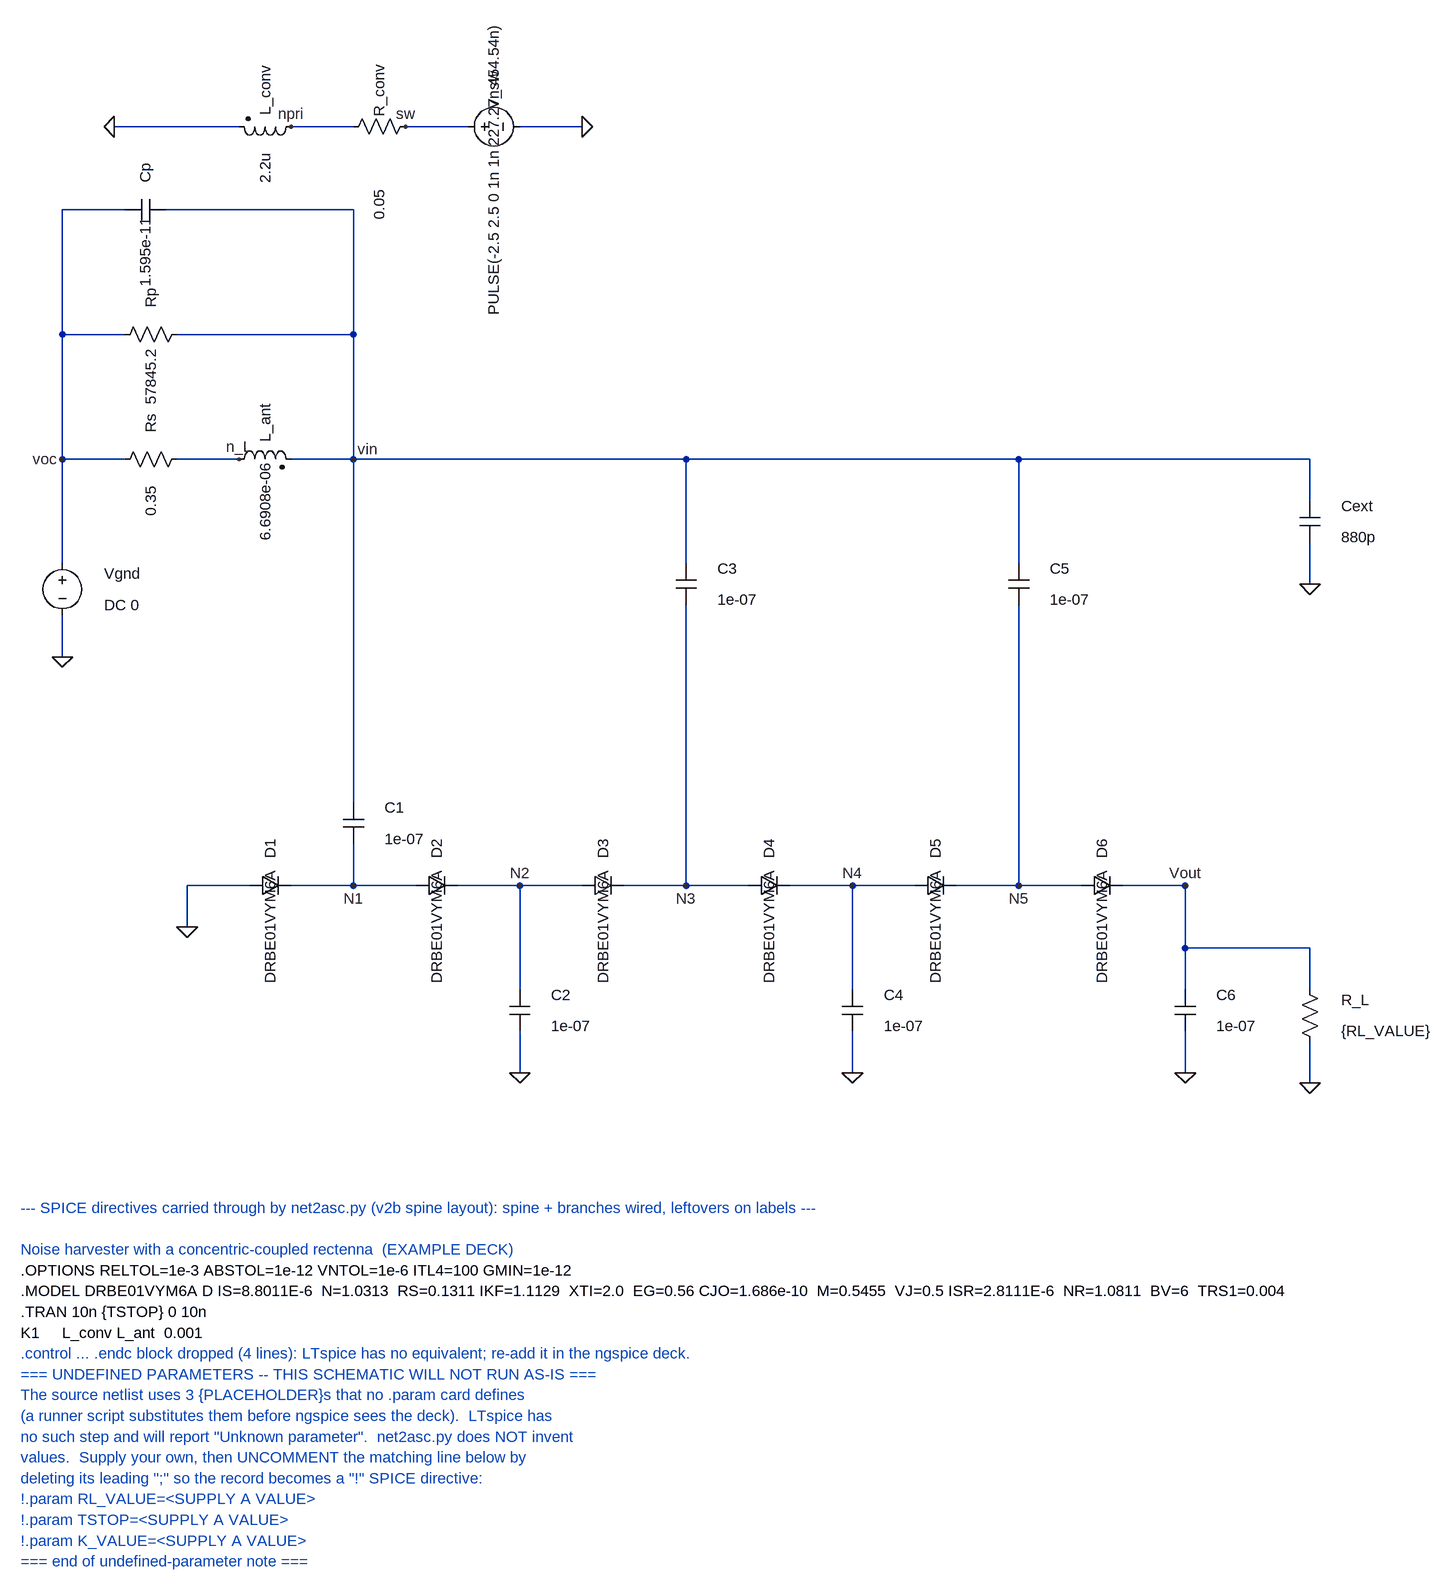
[diagram p0: schematic corrupt_G_kcoeff.asc]
corrupt_G_kcoeff.asc, the LTspice schematic file:
Version 4
SHEET 1 2688 2544
WIRE 320 1312 320 1376
WIRE 320 1312 416 1312
WIRE 480 1312 576 1312
WIRE 576 1312 672 1312
WIRE 736 1312 832 1312
WIRE 832 1312 928 1312
WIRE 992 1312 1088 1312
WIRE 1088 1312 1184 1312
WIRE 1248 1312 1344 1312
WIRE 1344 1312 1440 1312
WIRE 1504 1312 1600 1312
WIRE 1600 1312 1696 1312
WIRE 1760 1312 1856 1312
WIRE 576 1312 576 1248
WIRE 576 1184 576 656
WIRE 832 1312 832 1408
WIRE 832 1408 832 1472
WIRE 832 1536 832 1600
WIRE 576 656 1088 656
WIRE 1088 656 1088 752
WIRE 1088 752 1088 816
WIRE 1088 880 1088 1312
WIRE 1344 1312 1344 1408
WIRE 1344 1408 1344 1472
WIRE 1344 1536 1344 1600
WIRE 576 656 1600 656
WIRE 1600 656 1600 752
WIRE 1600 752 1600 816
WIRE 1600 880 1600 1312
WIRE 1856 1312 1856 1408
WIRE 1856 1408 1856 1472
WIRE 1856 1536 1856 1600
WIRE 1856 1312 1856 1408
WIRE 1856 1408 2048 1408
WIRE 2048 1408 2048 1472
WIRE 2048 1552 2048 1616
WIRE 576 656 480 656
WIRE 400 656 304 656
WIRE 224 656 128 656
WIRE 128 656 128 464
WIRE 128 464 224 464
WIRE 304 464 576 464
WIRE 576 464 576 656
WIRE 128 656 128 272
WIRE 128 272 224 272
WIRE 288 272 576 272
WIRE 576 272 576 656
WIRE 576 656 2048 656
WIRE 2048 656 2048 720
WIRE 2048 784 2048 848
WIRE 128 656 128 752
WIRE 128 752 128 816
WIRE 128 896 128 960
WIRE 208 144 304 144
WIRE 304 144 400 144
WIRE 480 144 576 144
WIRE 656 144 752 144
WIRE 832 144 928 144
FLAG 320 1376 0
FLAG 576 1312 N1
FLAG 832 1312 N2
FLAG 1088 1312 N3
FLAG 1344 1312 N4
FLAG 1600 1312 N5
FLAG 1856 1312 Vout
FLAG 576 656 vin
FLAG 832 1600 0
FLAG 1344 1600 0
FLAG 1856 1600 0
FLAG 2048 1616 0
FLAG 128 656 voc
FLAG 2048 848 0
FLAG 128 960 0
FLAG 208 144 0
FLAG 928 144 0
FLAG 400 656 n_L
FLAG 480 144 npri
FLAG 656 144 sw
SYMBOL diode 416 1328 R270
WINDOW 0 72 32 Center 2
WINDOW 3 -48 32 Center 2
SYMATTR InstName D1
SYMATTR Value DRBE01VYM6A
SYMBOL diode 672 1328 R270
WINDOW 0 72 32 Center 2
WINDOW 3 -48 32 Center 2
SYMATTR InstName D2
SYMATTR Value DRBE01VYM6A
SYMBOL diode 928 1328 R270
WINDOW 0 72 32 Center 2
WINDOW 3 -48 32 Center 2
SYMATTR InstName D3
SYMATTR Value DRBE01VYM6A
SYMBOL diode 1184 1328 R270
WINDOW 0 72 32 Center 2
WINDOW 3 -48 32 Center 2
SYMATTR InstName D4
SYMATTR Value DRBE01VYM6A
SYMBOL diode 1440 1328 R270
WINDOW 0 72 32 Center 2
WINDOW 3 -48 32 Center 2
SYMATTR InstName D5
SYMATTR Value DRBE01VYM6A
SYMBOL diode 1696 1328 R270
WINDOW 0 72 32 Center 2
WINDOW 3 -48 32 Center 2
SYMATTR InstName D6
SYMATTR Value DRBE01VYM6A
SYMBOL cap 560 1184 R0
WINDOW 0 64 8 Left 2
WINDOW 3 64 56 Left 2
SYMATTR InstName C1
SYMATTR Value 1e-07
SYMBOL cap 816 1472 R0
WINDOW 0 64 8 Left 2
WINDOW 3 64 56 Left 2
SYMATTR InstName C2
SYMATTR Value 1e-07
SYMBOL cap 1072 816 R0
WINDOW 0 64 8 Left 2
WINDOW 3 64 56 Left 2
SYMATTR InstName C3
SYMATTR Value 1e-07
SYMBOL cap 1328 1472 R0
WINDOW 0 64 8 Left 2
WINDOW 3 64 56 Left 2
SYMATTR InstName C4
SYMATTR Value 1e-07
SYMBOL cap 1584 816 R0
WINDOW 0 64 8 Left 2
WINDOW 3 64 56 Left 2
SYMATTR InstName C5
SYMATTR Value 1e-07
SYMBOL cap 1840 1472 R0
WINDOW 0 64 8 Left 2
WINDOW 3 64 56 Left 2
SYMATTR InstName C6
SYMATTR Value 1e-07
SYMBOL res 2032 1456 R0
WINDOW 0 64 32 Left 2
WINDOW 3 64 80 Left 2
SYMATTR InstName R_L
SYMATTR Value {RL_VALUE}
SYMBOL ind2 384 672 R270
WINDOW 0 72 56 Center 2
WINDOW 3 -48 56 Center 2
SYMATTR InstName L_ant
SYMATTR Value 6.6908e-06
SYMBOL res 208 672 R270
WINDOW 0 72 56 Center 2
WINDOW 3 -48 56 Center 2
SYMATTR InstName Rs
SYMATTR Value 0.35
SYMBOL res 208 480 R270
WINDOW 0 72 56 Center 2
WINDOW 3 -48 56 Center 2
SYMATTR InstName Rp
SYMATTR Value 57845.2
SYMBOL cap 224 288 R270
WINDOW 0 72 32 Center 2
WINDOW 3 -48 32 Center 2
SYMATTR InstName Cp
SYMATTR Value 1.595e-11
SYMBOL cap 2032 720 R0
WINDOW 0 64 8 Left 2
WINDOW 3 64 56 Left 2
SYMATTR InstName Cext
SYMATTR Value 880p
SYMBOL voltage 128 800 R0
WINDOW 0 64 32 Left 2
WINDOW 3 64 80 Left 2
SYMATTR InstName Vgnd
SYMATTR Value DC 0
SYMBOL ind2 496 128 R90
WINDOW 0 -40 56 Center 2
WINDOW 3 80 56 Center 2
SYMATTR InstName L_conv
SYMATTR Value 2.2u
SYMBOL res 672 128 R90
WINDOW 0 -40 56 Center 2
WINDOW 3 136 56 Center 2
SYMATTR InstName R_conv
SYMATTR Value 0.05
SYMBOL voltage 736 144 R270
WINDOW 0 56 56 Center 2
WINDOW 3 -64 56 Center 2
SYMATTR InstName V_sw
SYMATTR Value PULSE(-2.5 2.5 0 1n 1n 227.27n 454.54n)
TEXT 64 1808 Left 2 ;--- SPICE directives carried through by net2asc.py (v2b spine layout): spine + branches wired, leftovers on labels ---
TEXT 64 1872 Left 2 ;Noise harvester with a concentric-coupled rectenna  (EXAMPLE DECK)
TEXT 64 1904 Left 2 !.OPTIONS RELTOL=1e-3 ABSTOL=1e-12 VNTOL=1e-6 ITL4=100 GMIN=1e-12
TEXT 64 1936 Left 2 !.MODEL DRBE01VYM6A D IS=8.8011E-6  N=1.0313  RS=0.1311 IKF=1.1129  XTI=2.0  EG=0.56 CJO=1.686e-10  M=0.5455  VJ=0.5 ISR=2.8111E-6  NR=1.0811  BV=6  TRS1=0.004
TEXT 64 1968 Left 2 !.TRAN 10n {TSTOP} 0 10n
TEXT 64 2000 Left 2 !K1     L_conv L_ant  0.001
TEXT 64 2032 Left 2 ;.control ... .endc block dropped (4 lines): LTspice has no equivalent; re-add it in the ngspice deck.
TEXT 64 2064 Left 2 ;=== UNDEFINED PARAMETERS -- THIS SCHEMATIC WILL NOT RUN AS-IS ===
TEXT 64 2096 Left 2 ;The source netlist uses 3 {PLACEHOLDER}s that no .param card defines
TEXT 64 2128 Left 2 ;(a runner script substitutes them before ngspice sees the deck).  LTspice has
TEXT 64 2160 Left 2 ;no such step and will report "Unknown parameter".  net2asc.py does NOT invent
TEXT 64 2192 Left 2 ;values.  Supply your own, then UNCOMMENT the matching line below by
TEXT 64 2224 Left 2 ;deleting its leading ";" so the record becomes a "!" SPICE directive:
TEXT 64 2256 Left 2 ;!.param RL_VALUE=<SUPPLY A VALUE>
TEXT 64 2288 Left 2 ;!.param TSTOP=<SUPPLY A VALUE>
TEXT 64 2320 Left 2 ;!.param K_VALUE=<SUPPLY A VALUE>
TEXT 64 2352 Left 2 ;=== end of undefined-parameter note ===

The netlist it stands for:
* corrupt_G_kcoeff.asc
D1 0 N1 DRBE01VYM6A
D2 N1 N2 DRBE01VYM6A
D3 N2 N3 DRBE01VYM6A
D4 N3 N4 DRBE01VYM6A
D5 N4 N5 DRBE01VYM6A
D6 N5 Vout DRBE01VYM6A
C1 vin N1 1e-07
C2 N2 0 1e-07
C3 vin N3 1e-07
C4 N4 0 1e-07
C5 vin N5 1e-07
C6 Vout 0 1e-07
R_L Vout 0 {RL_VALUE}
L_ant n_L vin 6.6908e-06
Rs voc n_L 0.35
Rp voc vin 57845.2
Cp voc vin 1.595e-11
Cext vin 0 880p
Vgnd voc 0 DC 0
L_conv npri 0 2.2u
R_conv sw npri 0.05
V_sw sw 0 PULSE(-2.5 2.5 0 1n 1n 227.27n 454.54n)
.model D D
.lib standard.dio
* --- SPICE directives carried through by net2asc.py (v2b spine layout): spine + branches wired, leftovers on labels ---
* Noise harvester with a concentric-coupled rectenna  (EXAMPLE DECK)
.OPTIONS RELTOL=1e-3 ABSTOL=1e-12 VNTOL=1e-6 ITL4=100 GMIN=1e-12
.MODEL DRBE01VYM6A D IS=8.8011E-6  N=1.0313  RS=0.1311 IKF=1.1129  XTI=2.0  EG=0.56 CJO=1.686e-10  M=0.5455  VJ=0.5 ISR=2.8111E-6  NR=1.0811  BV=6  TRS1=0.004
.TRAN 10n {TSTOP} 0 10n
K1     L_conv L_ant  0.001
* .control ... .endc block dropped (4 lines): LTspice has no equivalent; re-add it in the ngspice deck.
* === UNDEFINED PARAMETERS -- THIS SCHEMATIC WILL NOT RUN AS-IS ===
* The source netlist uses 3 {PLACEHOLDER}s that no .param card defines
* (a runner script substitutes them before ngspice sees the deck).  LTspice has
* no such step and will report "Unknown parameter".  net2asc.py does NOT invent
* values.  Supply your own, then UNCOMMENT the matching line below by
* deleting its leading ";" so the record becomes a "!" SPICE directive:
* !.param RL_VALUE=<SUPPLY A VALUE>
* !.param TSTOP=<SUPPLY A VALUE>
* !.param K_VALUE=<SUPPLY A VALUE>
* === end of undefined-parameter note ===
.backanno
.end